# Altium schematic sheet board.SchDoc
size A4
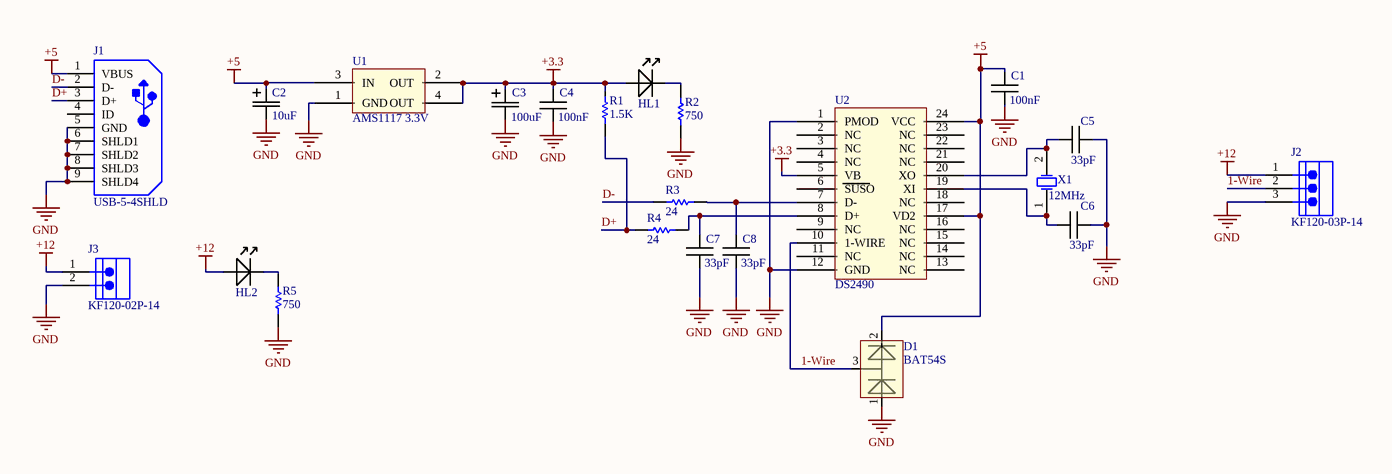
[diagram p0: board.SchDoc]

## Parts
C1  Val: 100nF  [CAP0805]  (hidden comment: CAP_SMD)
C2  Val: 10uF  [CAP_ELEC_5*11]  (hidden comment: CAP_ELEC_5*11)
C3  Val: 100uF  [CAP_ELEC_8*11]  (hidden comment: CAP_ELEC_8*11)
C4  Val: 100nF  [CAP0805]  (hidden comment: CAP_SMD)
C5  Val: 33pF  [CAP0805]  (hidden comment: CAP_SMD)
C6  Val: 33pF  [CAP0805]  (hidden comment: CAP_SMD)
C7  Val: 33pF  [CAP0805]  (hidden comment: CAP_SMD)
C8  Val: 33pF  [CAP0805]  (hidden comment: CAP_SMD)
D1  BAT54S  [SOT23 - 123]
HL1  LED_SMD  [1206_Led]  (value not drawn)
HL2  LED_SMD  [1206_Led]  (value not drawn)
J1  USB-5-4SHLD  [MINI-USB_2.0]
J2  KF120-03P-14  [KF350-3.5-03P]
J3  KF120-02P-14  [KF350-3.5-02P]
R1  Val: 1.5K  [RES0805]  (hidden comment: RES_SMD)
R2  Val: 750  [RES0805]  (hidden comment: RES_SMD)
R3  Val: 24  [RES0805]  (hidden comment: RES_SMD)
R4  Val: 24  [RES0805]  (hidden comment: RES_SMD)
R5  Val: 750  [RES0805]  (hidden comment: RES_SMD)
U1  AMS1117 3.3V  [SOT223-4]
U2  DS2490  [SOIC-24/300]
X1  Frequency: 12MHz  [Crystal_SMD]

## Nets
+3.3: C3.2 C4.2 HL1.1(anode) R1.2 U1.2(OUT) U1.4(OUT) U2.5(VB)
+5: C1.2 C2.2 D1.2(C) J1.1(VBUS) U1.3(IN) U2.17(VD2) U2.24(VCC)
+12: HL2.1(anode) J2.1 J3.1
GND: C1.1 C2.1 C3.1 C4.1 C5.2 C6.2 C7.1 C8.1 D1.1(A) J1.5(GND) J1.6(SHLD1) J1.7(SHLD2) J1.8(SHLD3) J1.9(SHLD4) J2.3 J3.2 R2.1 R5.1 U1.1(GND) U2.1(PMOD) U2.12(GND)
1-Wire: D1.3 J2.2 U2.10(1-WIRE)
D+: J1.3(D+) R1.1 R4.1
D-: J1.2(D-) R3.1
NetC5_1: C5.1 U2.20(XO) X1.2(X2)
NetC6_1: C6.1 U2.19(XI) X1.1(X1)
NetC7_2: C7.2 R4.2 U2.8(D+)
NetC8_2: C8.2 R3.2 U2.7(D-)
NetHL1_2: HL1.2(cathode) R2.2
NetHL2_2: HL2.2(cathode) R5.2

Not connected (* = marked no-connect by the designer): J1 4(ID); U2 2(NC) 3(NC) 4(NC) 6(SUSO) 9(NC) 11(NC) 13(NC) 14(NC) 15(NC) 16(NC) 18(NC) 21(NC) 22(NC) 23(NC)

## Library data of the parts
C1 C4-C8 = CAP_SMD: Ceramic capacitor, 0805
C2 = CAP_ELEC_5*11: Electrolitic capacitor
C3 = CAP_ELEC_8*11: Electrolitic capacitor
HL1 HL2 = LED_SMD: 0805 led
J1 = MINI_USB-5-4SHLD
J2 = Terminal_3: Euro Terminal Block, 6 A, 150 V, -40 to 105 degC, Pitch 2.54 mm, 1x3 Position, Height 8.6 mm, Tail Length 3.3 mm; Manufacturer: Cixi KaiFeng; Insulation Resistance: 5000 mOhm / 1000 V; Pitch: Single Pitch; Rated Current: 6 A; Contact: Brass; Contact Resistance: 20 mOhm; No. of Pole: 3; Rated Voltage: 150 V; Withstanding Voltage: AC 1500 V / 1 Min; DatasheetVersion: Dec-13; ComponentLink3URL: http://www.nb-kaifeng.com/upload/editor/ext_pdf/201305290533202245.pdf; ComponentLink1Description: Manufacturer URL; ComponentLink2URL: http://www.nb-kaifeng.com/upload/editor/ext_pdf/201305290533107785.pdf; ComponentLink3Description: Package Specification; Color: Green; ComponentLink1URL: http://www.nb-kaifeng.com/; ComponentLink2Description: Datasheet; PackageVersion: Dec-13; Temp. Range: -40 to 105 degC; Mounting Technology: Through Hole; PackageDescription: Terminal Block, Pitch 2.54 mm, 1 x 3 Position, Height 8.6 mm, Tail Length 3.3 mm; PartNumber: KF120-03P-14; PackageReference: CXKF-KF120-3
J3 = Terminal_2: Euro Terminal Block, 6 A, 150 V, -40 to 105 degC, Pitch 2.54 mm, 1x2 Position, Height 8.6 mm, Tail Length 3.3 mm; Manufacturer: Cixi KaiFeng; Rated Current: 6 A; Contact: Brass; Insulation Resistance: 5000 MOhm / 1000 V; Rated Voltage: 150 V; No. of Pole: 2; Withstanding Voltage: AC 1500 V / 1 Min; Contact Resistance: 20 mOhm; Pitch: Single Pitch; PackageReference: KF120-2; Color: Green; Mounting Technology: Through Hole; PartNumber: KF120-02P-14; PackageDescription: Terminal Block, Pitch 2.54 mm, 1 x 2 Position, Height 8.6 mm, Tail Length 3.3 mm; ComponentLink2Description: Datasheet; ComponentLink1Description: Manufacturer URL; ComponentLink2URL: http://www.nb-kaifeng.com/upload/editor/ext_pdf/201305290533202245.pdf; Temp. Range: -40 to 105 degC; ComponentLink1URL: http://www.nb-kaifeng.com/
U1 = AMS1117: Voltage regulator
U2 = DS2490: DS2490, SO-24
X1 = Crystal: Low Profile Crystal; Brand: ABRACON; Case Length: 11.4mm; Frequency Stability: 50PPM; ESR: 80Ohms; Case Height: 4.2mm; Tolerance: 30PPM; Case Width: 4.7mm; Load Capacitance: 18pF; Datasheet Version: 04/2011; Termination Style: SMD/SMT; Dimensions: 4.7mmWx11.4mmLx4.2mmH; Packaging: Reel; Manufacturer: ABRACON; Package URL: http://www.abracon.com/Support/PackageDrawing/Resonators/ABLS-2D.pdf; Mounting Technology: SurfaceMount; Package Reference: ABLS-14.7456MHZ-B2-T; Product Category: Crystals; Package Description: 2-Pin Surface Mount Device, Body 11.4 x 4.7 mm; Package / Case: HC-49/US; Mounting Style: SMD/SMT; Operating Temperature Range: -20Cto+70C; Series: ABLS; Factory Pack Quantity: 1000; Datasheet URL: http://www.abracon.com/Resonators/abls.pdf; Manufacturer URL: http://www.abracon.com/; RoHS: Details; Type: LowProfileMicroprocessorCrystal